# Altium schematic sheet main.SchDoc
size A
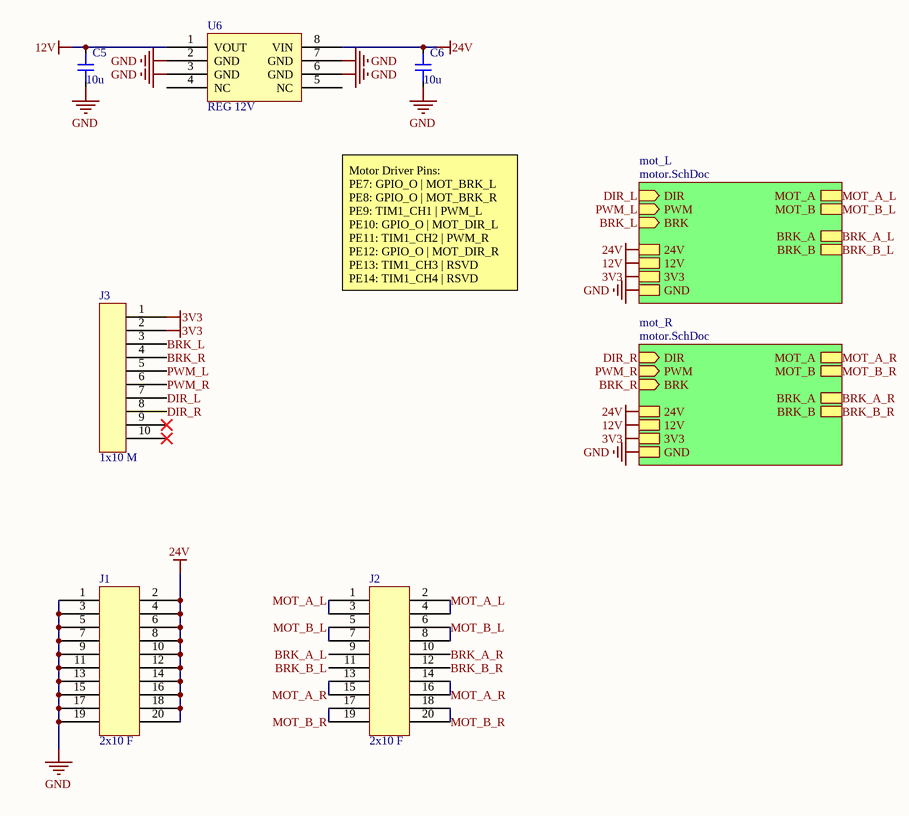
[diagram p0: main.SchDoc]

## Parts
C5  10u  [CAP 0805 L]
C6  10u  [CAP 0805 L]
J1  2x10 F  [CONN HDR 2x10 F BOT]
J2  2x10 F  [CONN HDR 2x10 F BOT]
J3  1x10 M  [CONN HDR 1x10 M]
U6  REG 12V  [SOIC-8]

## Sub-sheets
mot_L = motor.SchDoc: DIR (in), PWM (in), 3V3, GND, MOT_A, MOT_B, BRK_A, BRK_B, BRK (in), 12V, 24V
mot_R = motor.SchDoc: DIR (in), PWM (in), 3V3, GND, MOT_A, MOT_B, BRK_A, BRK_B, BRK (in), 12V, 24V

## Nets
3V3: J3.1 J3.2 ; sheet mot_L/3V3, sheet mot_R/3V3
12V: C5.2 U6.1(VOUT) ; sheet mot_L/12V, sheet mot_R/12V
24V: C6.2 J1.2 J1.4 J1.6 J1.8 J1.10 J1.12 J1.14 J1.16 J1.18 J1.20 U6.8(VIN) ; sheet mot_L/24V, sheet mot_R/24V
GND: C5.1 C6.1 J1.1 J1.3 J1.5 J1.7 J1.9 J1.11 J1.13 J1.15 J1.17 J1.19 U6.2(GND) U6.3(GND) U6.6(GND) U6.7(GND) ; sheet mot_L/GND, sheet mot_R/GND
BRK_A_L: J2.9 ; sheet mot_L/BRK_A
BRK_A_R: J2.10 ; sheet mot_R/BRK_A
BRK_B_L: J2.11 ; sheet mot_L/BRK_B
BRK_B_R: J2.12 ; sheet mot_R/BRK_B
BRK_L: J3.3 ; sheet mot_L/BRK
BRK_R: J3.4 ; sheet mot_R/BRK
DIR_L: J3.7 ; sheet mot_L/DIR
DIR_R: J3.8 ; sheet mot_R/DIR
MOT_A_L: J2.1 J2.2 J2.3 J2.4 ; sheet mot_L/MOT_A
MOT_A_R: J2.13 J2.14 J2.15 J2.16 ; sheet mot_R/MOT_A
MOT_B_L: J2.5 J2.6 J2.7 J2.8 ; sheet mot_L/MOT_B
MOT_B_R: J2.17 J2.18 J2.19 J2.20 ; sheet mot_R/MOT_B
PWM_L: J3.5 ; sheet mot_L/PWM
PWM_R: J3.6 ; sheet mot_R/PWM

Not connected (* = marked no-connect by the designer): J3 9* 10*; U6 4(NC) 5(NC)

## Notes on the sheet
- Motor Driver Pins:
  PE7: GPIO_O | MOT_BRK_L
  PE8: GPIO_O | MOT_BRK_R
  PE9: TIM1_CH1 | PWM_L
  PE10: GPIO_O | MOT_DIR_L
  PE11: TIM1_CH2 | PWM_R
  PE12: GPIO_O | MOT_DIR_R
  PE13: TIM1_CH3 | RSVD
  PE14: TIM1_CH4 | RSVD

## Library data of the parts
C5 C6 = CAP 0805
J1 J2 = CONN Header 2x10 F: SFH11-PBPC-D10-ST-BK; Supplier 1: Digi-Key; Supplier Part Number 1: S9197-ND
J3 = CONN header 1x10 M
U6 = IC REG 12V LINEAR: L78L12ABD-TR; Supplier 1: Digi-Key; Supplier Part Number 1: 497-7767-1-ND